# EasyEDA schematic SCH_uCompute_VGA_adaptor_2025-12-26.json
TITLE: VGA16 uCompute adapter; REV: 1.0; Date: 2025-12-26; Sheet: 1/1; Drawn By: greatjp; Company: Your Company
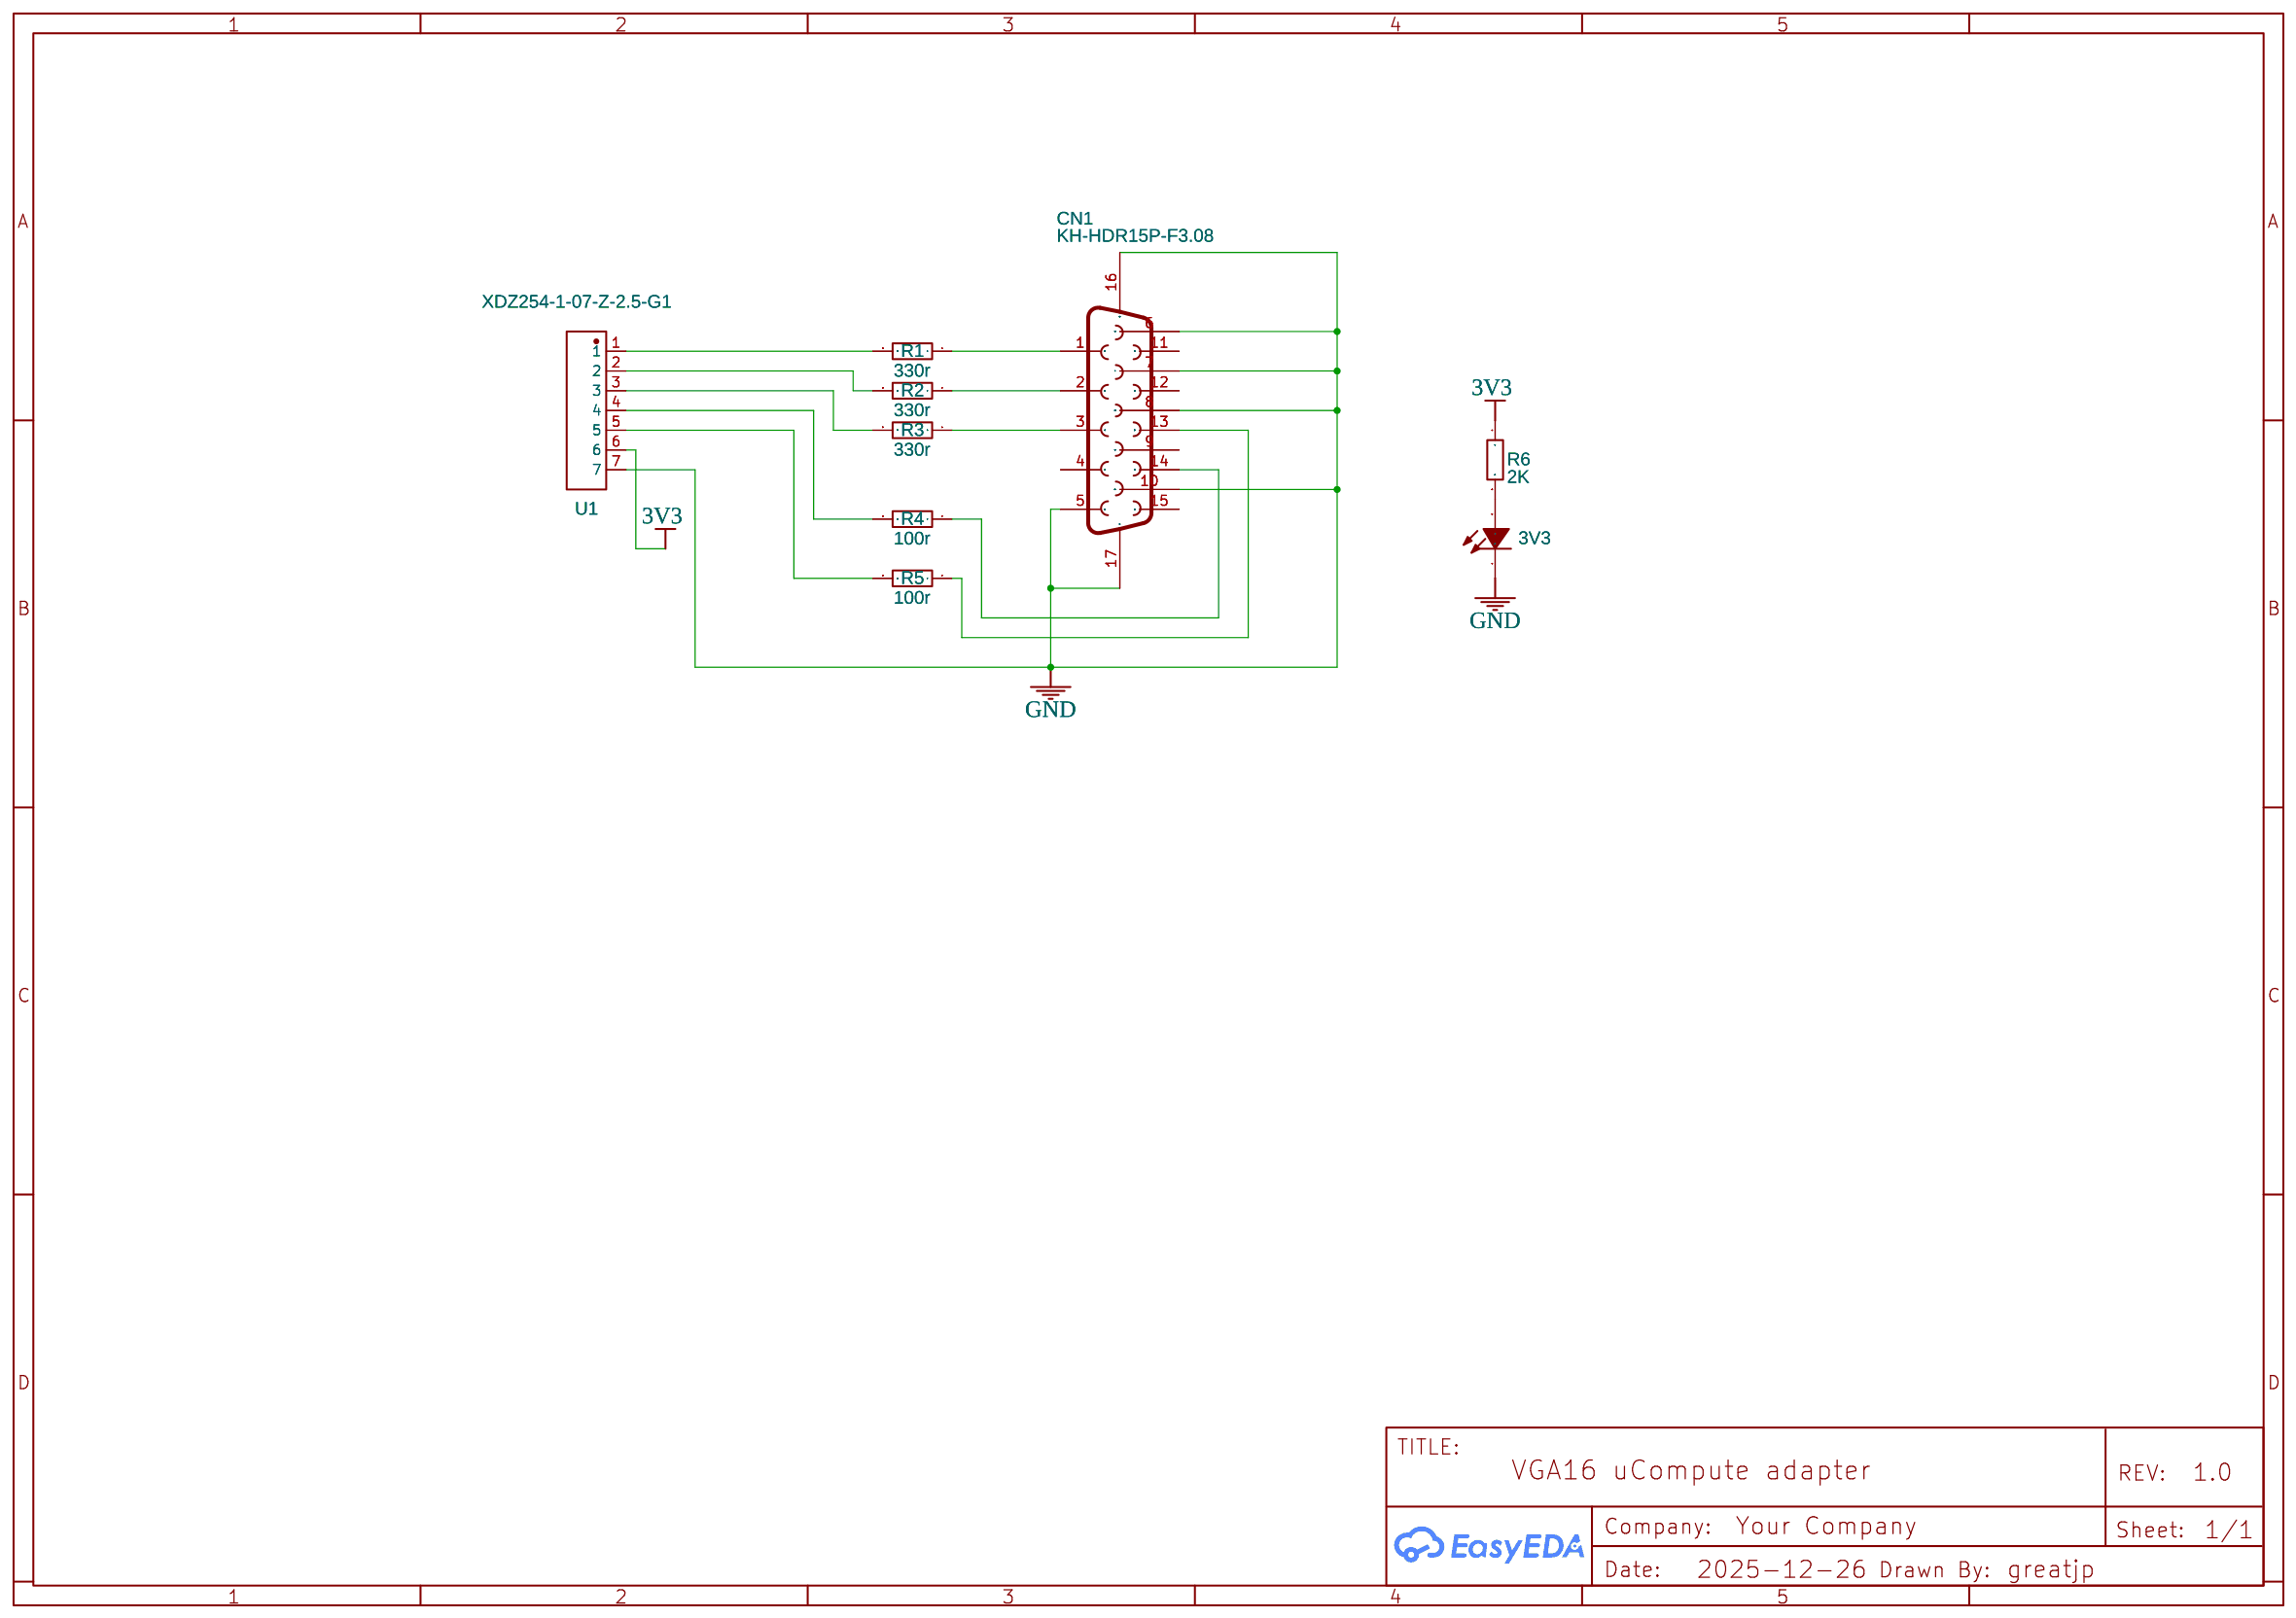
[diagram p0: schematic sheet]

## Parts
3V3  XL-1206QPC  [LED0805-RD_BLUE]
CN1  KH-HDR15P-F3.08  [DSUB-TH_KH-HDR15P-F3.08-VGA]
R1  330r  [R0805]
R2  330r  [R0805]
R3  330r  [R0805]
R4  100r  [R0805]
R5  100r  [R0805]
R6  2K  [R0805]
U1  XDZ254-1-07-Z-2.5-G1  [HDR-TH_7P-P2.54-V-M]

## Library data of the parts
3V3 = XL-1206QPC: Supplier: LCSC; Manufacturer: LCSC; Supplier Part: C10781; JLCPCB Part Class: Extended Part; Package Display: No
CN1 = KH-HDR15P-F3.08: Supplier: LCSC; Supplier Part: C3038673; Manufacturer: kinghelm(金航标); Contributor: lcsc; JLCPCB Part Class: Extended Part
R1-R6 = RC0805DR-071KL: Supplier: LCSC; Manufacturer: YAGEO(国巨); Contributor: LCSC; Supplier Part: C100051; JLCPCB Part Class: Extended Part; Resistance: 1kΩ
U1 = XDZ254-1-07-Z-2.5-G1: Supplier: LCSC; Supplier Part: C18905848; Manufacturer: XUNDA(讯答); Contributor: lcsc; JLCPCB Part Class: Extended Part

## Nets
3V3: R6.1 U1.6
GND: 3V3.1(K) CN1.5 CN1.6 CN1.7 CN1.8 CN1.10 CN1.16 CN1.17 U1.7
Net-(3V3-2): 3V3.2(A) R6.2
Net-(CN1-1): CN1.1 R1.1
Net-(CN1-2): CN1.2 R2.1
Net-(CN1-3): CN1.3 R3.1
Net-(CN1-13): CN1.13 R5.1
Net-(CN1-14): CN1.14 R4.1
Net-(R1-2): R1.2 U1.1
Net-(R2-2): R2.2 U1.2
Net-(R3-2): R3.2 U1.3
Net-(R4-2): R4.2 U1.4
Net-(R5-2): R5.2 U1.5

Not connected (* = marked no-connect by the designer): CN1 4 9 11 12 15
